# Altium schematic sheet FUC.SchDoc
size A4; SheetNumber: 1; SheetTotal: 1
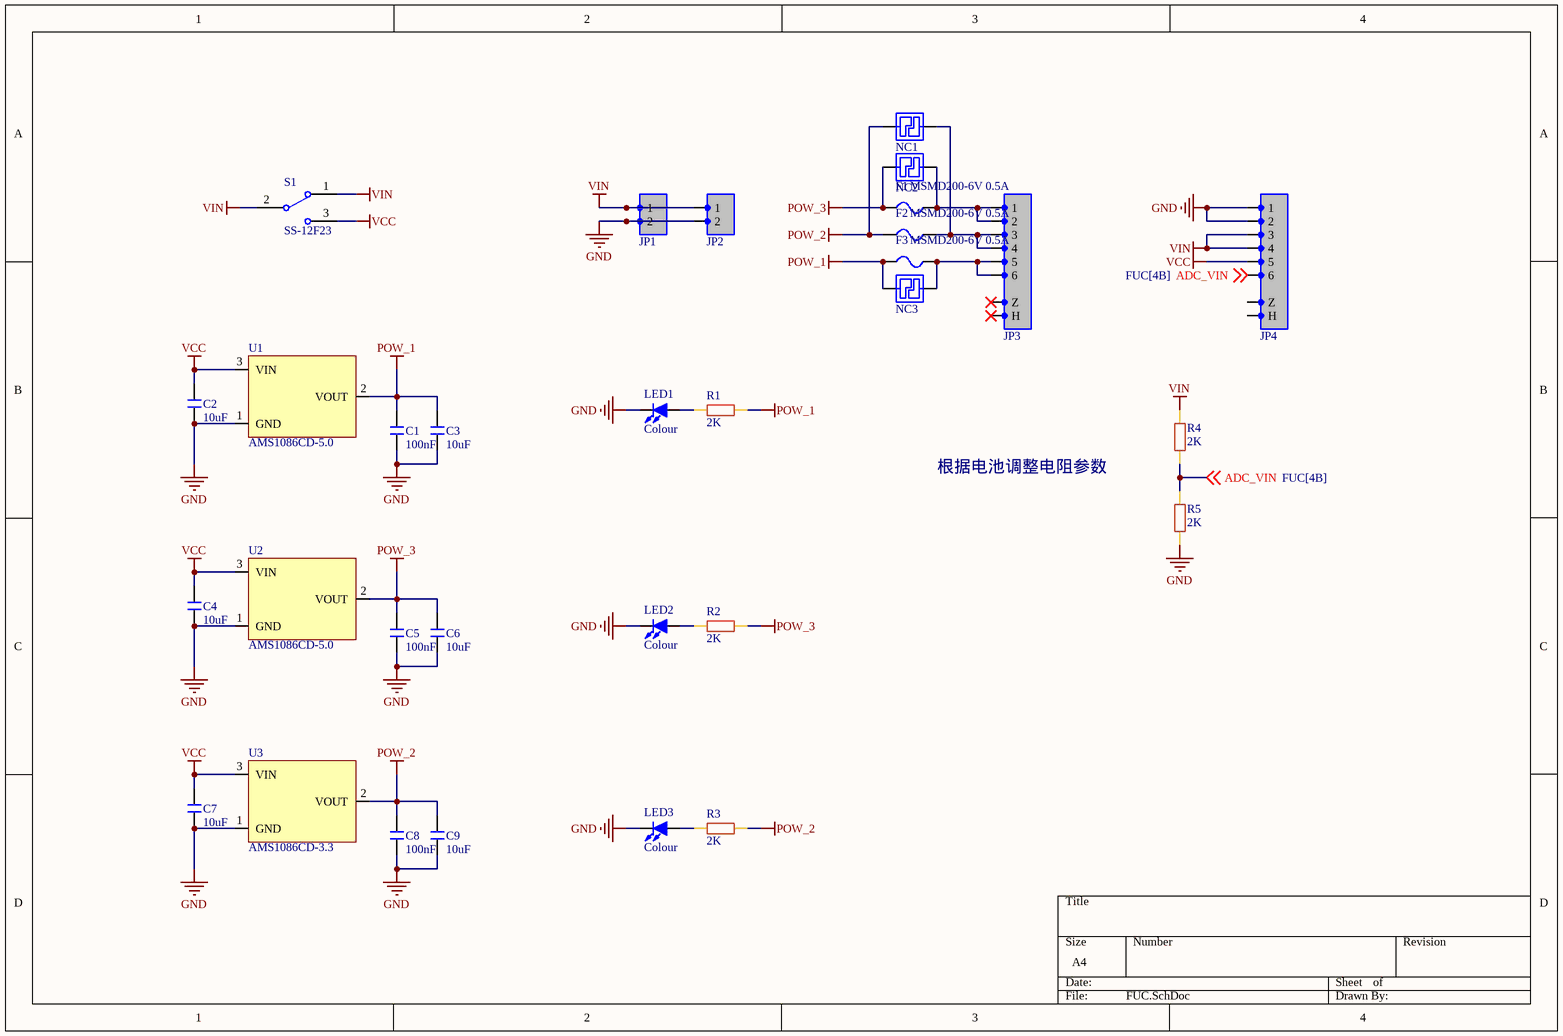
[diagram p0: FUC.SchDoc]

## Parts
C1  100nF  [C 0603_L]
C2  10uF  [C 0603_L]
C3  10uF  [C 0603_L]
C4  10uF  [C 0603_L]
C5  100nF  [C 0603_L]
C6  10uF  [C 0603_L]
C7  10uF  [C 0603_L]
C8  100nF  [C 0603_L]
C9  10uF  [C 0603_L]
F1  MSMD200-6V 0.5A  [FU 0805]
F2  MSMD200-6V 0.5A  [FU 0805]
F3  MSMD200-6V 0.5A  [FU 0805]
JP1  HDR-1X2  [XH2.54-WI-2P]  (value not drawn)
JP2  HDR-1X2  [HDR2.54-LI-2P]  (value not drawn)
JP3  HDR-1X6  [HDR2.54-LI-6P]  (value not drawn)
JP4  HDR-1X6  [HDR2.54-LI-6P]  (value not drawn)
LED1  Colour  [LED 0603R]
LED2  Colour  [LED 0603R]
LED3  Colour  [LED 0603R]
NC1  Node  [NODE-2]  (value not drawn)
NC2  Node  [NODE-2]  (value not drawn)
NC3  Node  [NODE-2]  (value not drawn)
R1  2K  [R 0603_L]
R2  2K  [R 0603_L]
R3  2K  [R 0603_L]
R4  2K  [R 0603_L]
R5  2K  [R 0603_L]
S1  SS-12F23  [SS-12D10]
U1  AMS1086CD-5.0  [TO252]
U2  AMS1086CD-5.0  [TO252]
U3  AMS1086CD-3.3  [TO252]

## Nets
GND: C1.2 C2.2 C3.2 C4.2 C5.2 C6.2 C7.2 C8.2 C9.2 JP1.2 JP2.2 JP4.1 JP4.2 LED1.2(K) LED2.2(K) LED3.2(K) R5.2 U1.1(GND) U2.1(GND) U3.1(GND)
POW_1: C1.1 C3.1 F3.1 NC3.1 R1.1 U1.2(VOUT)
POW_2: C8.1 C9.1 F2.1 NC1.1 R3.1 U3.2(VOUT)
POW_3: C5.1 C6.1 F1.1 NC2.1 R2.1 U2.2(VOUT)
VCC: C2.1 C4.1 C7.1 JP4.5 S1.3 U1.3(VIN) U2.3(VIN) U3.3(VIN)
VIN: JP1.1 JP2.1 JP4.3 JP4.4 R4.1 S1.1 S1.2
ADC_VIN: JP4.6 R4.2 R5.1 ; off-sheet ADC_VIN
NetF1_2: F1.2 JP3.1 JP3.2 NC2.2
NetF2_2: F2.2 JP3.3 JP3.4 NC1.2
NetF3_2: F3.2 JP3.5 JP3.6 NC3.2
NetLED1_1: LED1.1(A) R1.2
NetLED2_1: LED2.1(A) R2.2
NetLED3_1: LED3.1(A) R3.2

Not connected (* = marked no-connect by the designer): JP3 0(Z)* 100(H)*; JP4 0(Z) 100(H)

## Notes on the sheet
- 根据电池调整电阻参数

## Library data of the parts
C1-C9 = C: 无极性贴片电容; 版权归属: 源创客; BOM名称: 无极性贴片电容; 学习资源: www.ooocke.com
F1-F3 = FU: 贴片保险丝; 版权归属: 源创客; BOM名称: 贴片保险丝; 学习资源: www.ooocke.com
JP1 JP2 = Header 2: 2P接插件; 版权归属: 源创客; BOM名称: 2P接插件; 学习资源: www.ooocke.com
JP3 JP4 = Header 6: 6P接插件; 版权归属: 源创客; BOM名称: 6P接插件; 学习资源: www.ooocke.com
LED1-LED3 = LED-SMD: 贴片LED; 版权归属: 源创客; BOM名称: 贴片LED; 学习资源: www.ooocke.com
NC1-NC3 = NODE: 大电流节点
R1-R5 = 电阻: 贴片电阻1%精度
S1 = SSW-1P: 1路拨动开关; BOM名称: 波动开关; 版权归属: 源创客; 学习资源: www.ooocke.com
U3 = AMS1086CD-5.0